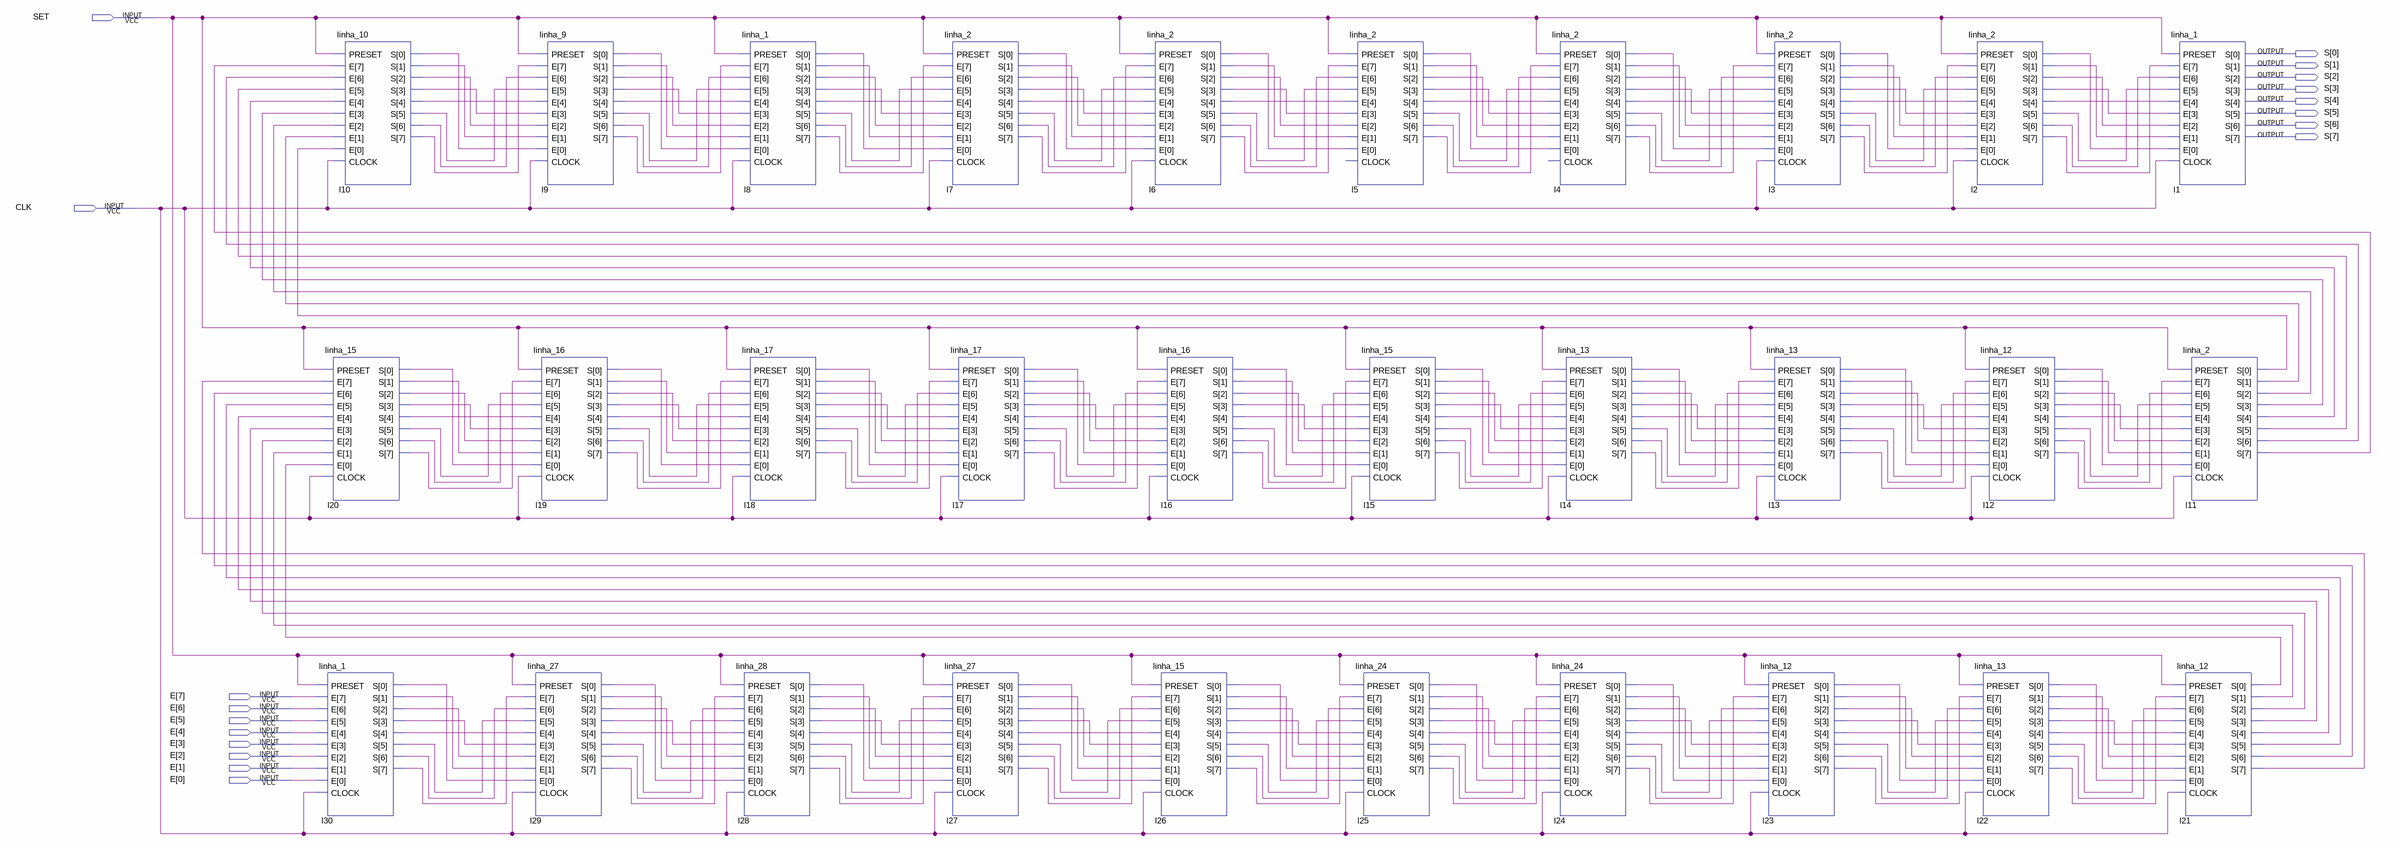
[diagram p0: schematic sheet]
// Quartus schematic mapa_completo.bdf as structural Verilog: 30 symbols, 18 pins
module mapa_completo (
  input  SET,
  input  CLK,
  input  [7:0] E,
  output [7:0] S
);

  wire l2_s, l2_s_2, l2_s_3, l2_s_4, l2_s_5, l2_s_6, l2_s_7, l2_s_8, l3_s, l3_s_2, l3_s_3, l3_s_4, l3_s_5,
       l3_s_6, l3_s_7, l3_s_8, l4_s, l4_s_2, l4_s_3, l4_s_4, l4_s_5, l4_s_6, l4_s_7, l4_s_8, l5_s, l5_s_2,
       l5_s_3, l5_s_4, l5_s_5, l5_s_6, l5_s_7, l5_s_8, l6_s, l6_s_2, l6_s_3, l6_s_4, l6_s_5, l6_s_6, l6_s_7,
       l6_s_8, l7_s, l7_s_2, l7_s_3, l7_s_4, l7_s_5, l7_s_6, l7_s_7, l7_s_8, l8_s, l8_s_2, l8_s_3, l8_s_4,
       l8_s_5, l8_s_6, l8_s_7, l8_s_8, l9_s, l9_s_2, l9_s_3, l9_s_4, l9_s_5, l9_s_6, l9_s_7, l9_s_8, l10_s,
       l10_s_2, l10_s_3, l10_s_4, l10_s_5, l10_s_6, l10_s_7, l10_s_8, l11_s, l11_s_2, l11_s_3, l11_s_4,
       l11_s_5, l11_s_6, l11_s_7, l11_s_8, l12_s, l12_s_2, l12_s_3, l12_s_4, l12_s_5, l12_s_6, l12_s_7,
       l12_s_8, l13_s, l13_s_2, l13_s_3, l13_s_4, l13_s_5, l13_s_6, l13_s_7, l13_s_8, l14_s, l14_s_2,
       l14_s_3, l14_s_4, l14_s_5, l14_s_6, l14_s_7, l14_s_8, l15_s, l15_s_2, l15_s_3, l15_s_4, l15_s_5,
       l15_s_6, l15_s_7, l15_s_8, l16_s, l16_s_2, l16_s_3, l16_s_4, l16_s_5, l16_s_6, l16_s_7, l16_s_8,
       l17_s, l17_s_2, l17_s_3, l17_s_4, l17_s_5, l17_s_6, l17_s_7, l17_s_8, l18_s, l18_s_2, l18_s_3,
       l18_s_4, l18_s_5, l18_s_6, l18_s_7, l18_s_8, l19_s, l19_s_2, l19_s_3, l19_s_4, l19_s_5, l19_s_6,
       l19_s_7, l19_s_8, l20_s, l20_s_2, l20_s_3, l20_s_4, l20_s_5, l20_s_6, l20_s_7, l20_s_8, l21_s,
       l21_s_2, l21_s_3, l21_s_4, l21_s_5, l21_s_6, l21_s_7, l21_s_8, l22_s, l22_s_2, l22_s_3, l22_s_4,
       l22_s_5, l22_s_6, l22_s_7, l22_s_8, l23_s, l23_s_2, l23_s_3, l23_s_4, l23_s_5, l23_s_6, l23_s_7,
       l23_s_8, l24_s, l24_s_2, l24_s_3, l24_s_4, l24_s_5, l24_s_6, l24_s_7, l24_s_8, l25_s, l25_s_2,
       l25_s_3, l25_s_4, l25_s_5, l25_s_6, l25_s_7, l25_s_8, l26_s, l26_s_2, l26_s_3, l26_s_4, l26_s_5,
       l26_s_6, l26_s_7, l26_s_8, l27_s, l27_s_2, l27_s_3, l27_s_4, l27_s_5, l27_s_6, l27_s_7, l27_s_8,
       l28_s, l28_s_2, l28_s_3, l28_s_4, l28_s_5, l28_s_6, l28_s_7, l28_s_8, l29_s, l29_s_2, l29_s_3,
       l29_s_4, l29_s_5, l29_s_6, l29_s_7, l29_s_8, l30_s, l30_s_2, l30_s_3, l30_s_4, l30_s_5, l30_s_6,
       l30_s_7, l30_s_8;

  linha_15 l20 (
    .PRESET(SET), .E({l21_s_8, l21_s_7, l21_s_6, l21_s_5, l21_s_4, l21_s_3, l21_s_2, l21_s}), .CLOCK(CLK),
    .S({l20_s_3, l20_s_2, l20_s, l20_s_8, l20_s_4, l20_s_5, l20_s_6, l20_s_7}));
  linha_1 l30 (
    .PRESET(SET), .E(E), .CLOCK(CLK),
    .S({l30_s_3, l30_s_2, l30_s, l30_s_8, l30_s_4, l30_s_5, l30_s_6, l30_s_7}));
  linha_10 l10 (
    .PRESET(SET), .E({l11_s, l11_s_2, l11_s_3, l11_s_4, l11_s_5, l11_s_6, l11_s_7, l11_s_8}), .CLOCK(CLK),
    .S({l10_s_3, l10_s_2, l10_s, l10_s_8, l10_s_4, l10_s_5, l10_s_6, l10_s_7}));
  linha_9 l9 (
    .PRESET(SET), .E({l10_s_3, l10_s_2, l10_s, l10_s_8, l10_s_4, l10_s_5, l10_s_6, l10_s_7}), .CLOCK(CLK),
    .S({l9_s_3, l9_s_2, l9_s, l9_s_8, l9_s_4, l9_s_5, l9_s_6, l9_s_7}));
  linha_16 l19 (
    .PRESET(SET), .E({l20_s_3, l20_s_2, l20_s, l20_s_8, l20_s_4, l20_s_5, l20_s_6, l20_s_7}), .CLOCK(CLK),
    .S({l19_s_3, l19_s_2, l19_s, l19_s_8, l19_s_4, l19_s_5, l19_s_6, l19_s_7}));
  linha_27 l29 (
    .PRESET(SET), .E({l30_s_3, l30_s_2, l30_s, l30_s_8, l30_s_4, l30_s_5, l30_s_6, l30_s_7}), .CLOCK(CLK),
    .S({l29_s_3, l29_s_2, l29_s, l29_s_8, l29_s_4, l29_s_5, l29_s_6, l29_s_7}));
  linha_1 l8 (
    .PRESET(SET), .E({l9_s_3, l9_s_2, l9_s, l9_s_8, l9_s_4, l9_s_5, l9_s_6, l9_s_7}), .CLOCK(CLK),
    .S({l8_s_3, l8_s_2, l8_s, l8_s_8, l8_s_4, l8_s_5, l8_s_6, l8_s_7}));
  linha_17 l18 (
    .PRESET(SET), .E({l19_s_3, l19_s_2, l19_s, l19_s_8, l19_s_4, l19_s_5, l19_s_6, l19_s_7}), .CLOCK(CLK),
    .S({l18_s_3, l18_s_2, l18_s, l18_s_8, l18_s_4, l18_s_5, l18_s_6, l18_s_7}));
  linha_28 l28 (
    .PRESET(SET), .E({l29_s_3, l29_s_2, l29_s, l29_s_8, l29_s_4, l29_s_5, l29_s_6, l29_s_7}), .CLOCK(CLK),
    .S({l28_s_3, l28_s_2, l28_s, l28_s_8, l28_s_4, l28_s_5, l28_s_6, l28_s_7}));
  linha_2 l7 (
    .PRESET(SET), .E({l8_s_3, l8_s_2, l8_s, l8_s_8, l8_s_4, l8_s_5, l8_s_6, l8_s_7}), .CLOCK(CLK),
    .S({l7_s_3, l7_s_2, l7_s, l7_s_8, l7_s_4, l7_s_5, l7_s_6, l7_s_7}));
  linha_17 l17 (
    .PRESET(SET), .E({l18_s_3, l18_s_2, l18_s, l18_s_8, l18_s_4, l18_s_5, l18_s_6, l18_s_7}), .CLOCK(CLK),
    .S({l17_s_3, l17_s_2, l17_s, l17_s_8, l17_s_4, l17_s_5, l17_s_6, l17_s_7}));
  linha_27 l27 (
    .PRESET(SET), .E({l28_s_3, l28_s_2, l28_s, l28_s_8, l28_s_4, l28_s_5, l28_s_6, l28_s_7}), .CLOCK(CLK),
    .S({l27_s_3, l27_s_2, l27_s, l27_s_8, l27_s_4, l27_s_5, l27_s_6, l27_s_7}));
  linha_2 l6 (
    .PRESET(SET), .E({l7_s_3, l7_s_2, l7_s, l7_s_8, l7_s_4, l7_s_5, l7_s_6, l7_s_7}), .CLOCK(CLK),
    .S({l6_s_3, l6_s_2, l6_s, l6_s_8, l6_s_4, l6_s_5, l6_s_6, l6_s_7}));
  linha_16 l16 (
    .PRESET(SET), .E({l17_s_3, l17_s_2, l17_s, l17_s_8, l17_s_4, l17_s_5, l17_s_6, l17_s_7}), .CLOCK(CLK),
    .S({l16_s_3, l16_s_2, l16_s, l16_s_8, l16_s_4, l16_s_5, l16_s_6, l16_s_7}));
  linha_15 l26 (
    .PRESET(SET), .E({l27_s_3, l27_s_2, l27_s, l27_s_8, l27_s_4, l27_s_5, l27_s_6, l27_s_7}), .CLOCK(CLK),
    .S({l26_s_3, l26_s_2, l26_s, l26_s_8, l26_s_4, l26_s_5, l26_s_6, l26_s_7}));
  linha_2 l5 (
    .PRESET(SET), .E({l6_s_3, l6_s_2, l6_s, l6_s_8, l6_s_4, l6_s_5, l6_s_6, l6_s_7}),
    .S({l5_s_3, l5_s_2, l5_s, l5_s_8, l5_s_4, l5_s_5, l5_s_6, l5_s_7}));  // open: CLOCK
  linha_15 l15 (
    .PRESET(SET), .E({l16_s_3, l16_s_2, l16_s, l16_s_8, l16_s_4, l16_s_5, l16_s_6, l16_s_7}), .CLOCK(CLK),
    .S({l15_s_3, l15_s_2, l15_s, l15_s_8, l15_s_4, l15_s_5, l15_s_6, l15_s_7}));
  linha_24 l25 (
    .PRESET(SET), .E({l26_s_3, l26_s_2, l26_s, l26_s_8, l26_s_4, l26_s_5, l26_s_6, l26_s_7}), .CLOCK(CLK),
    .S({l25_s_3, l25_s_2, l25_s, l25_s_8, l25_s_4, l25_s_5, l25_s_6, l25_s_7}));
  linha_2 l4 (
    .PRESET(SET), .E({l5_s_3, l5_s_2, l5_s, l5_s_8, l5_s_4, l5_s_5, l5_s_6, l5_s_7}),
    .S({l4_s_7, l4_s_6, l4_s_5, l4_s_8, l4_s_4, l4_s_3, l4_s_2, l4_s}));  // open: CLOCK
  linha_13 l14 (
    .PRESET(SET), .E({l15_s_3, l15_s_2, l15_s, l15_s_8, l15_s_4, l15_s_5, l15_s_6, l15_s_7}), .CLOCK(CLK),
    .S({l14_s_3, l14_s_2, l14_s, l14_s_8, l14_s_4, l14_s_5, l14_s_6, l14_s_7}));
  linha_24 l24 (
    .PRESET(SET), .E({l25_s_3, l25_s_2, l25_s, l25_s_8, l25_s_4, l25_s_5, l25_s_6, l25_s_7}), .CLOCK(CLK),
    .S({l24_s_3, l24_s_2, l24_s, l24_s_8, l24_s_4, l24_s_5, l24_s_6, l24_s_7}));
  linha_12 l23 (
    .PRESET(SET), .E({l24_s_3, l24_s_2, l24_s, l24_s_8, l24_s_4, l24_s_5, l24_s_6, l24_s_7}), .CLOCK(CLK),
    .S({l23_s_3, l23_s_2, l23_s, l23_s_8, l23_s_4, l23_s_5, l23_s_6, l23_s_7}));
  linha_2 l3 (
    .PRESET(SET), .E({l4_s_7, l4_s_6, l4_s_5, l4_s_8, l4_s_4, l4_s_3, l4_s_2, l4_s}), .CLOCK(CLK),
    .S({l3_s_3, l3_s_2, l3_s, l3_s_8, l3_s_4, l3_s_5, l3_s_6, l3_s_7}));
  linha_13 l13 (
    .PRESET(SET), .E({l14_s_3, l14_s_2, l14_s, l14_s_8, l14_s_4, l14_s_5, l14_s_6, l14_s_7}), .CLOCK(CLK),
    .S({l13_s_3, l13_s_2, l13_s, l13_s_8, l13_s_4, l13_s_5, l13_s_6, l13_s_7}));
  linha_2 l2 (
    .PRESET(SET), .E({l3_s_3, l3_s_2, l3_s, l3_s_8, l3_s_4, l3_s_5, l3_s_6, l3_s_7}), .CLOCK(CLK),
    .S({l2_s_3, l2_s_2, l2_s, l2_s_8, l2_s_4, l2_s_5, l2_s_6, l2_s_7}));
  linha_12 l12 (
    .PRESET(SET), .E({l13_s_3, l13_s_2, l13_s, l13_s_8, l13_s_4, l13_s_5, l13_s_6, l13_s_7}), .CLOCK(CLK),
    .S({l12_s_3, l12_s_2, l12_s, l12_s_8, l12_s_4, l12_s_5, l12_s_6, l12_s_7}));
  linha_13 l22 (
    .PRESET(SET), .E({l23_s_3, l23_s_2, l23_s, l23_s_8, l23_s_4, l23_s_5, l23_s_6, l23_s_7}), .CLOCK(CLK),
    .S({l22_s_3, l22_s_2, l22_s, l22_s_8, l22_s_4, l22_s_5, l22_s_6, l22_s_7}));
  linha_1 l1 (.PRESET(SET), .E({l2_s_3, l2_s_2, l2_s, l2_s_8, l2_s_4, l2_s_5, l2_s_6, l2_s_7}), .CLOCK(CLK), .S(S));
  linha_2 l11 (
    .PRESET(SET), .E({l12_s_3, l12_s_2, l12_s, l12_s_8, l12_s_4, l12_s_5, l12_s_6, l12_s_7}), .CLOCK(CLK),
    .S({l11_s, l11_s_2, l11_s_3, l11_s_4, l11_s_5, l11_s_6, l11_s_7, l11_s_8}));
  linha_12 l21 (
    .PRESET(SET), .E({l22_s_3, l22_s_2, l22_s, l22_s_8, l22_s_4, l22_s_5, l22_s_6, l22_s_7}), .CLOCK(CLK),
    .S({l21_s_8, l21_s_7, l21_s_6, l21_s_5, l21_s_4, l21_s_3, l21_s_2, l21_s}));
endmodule
